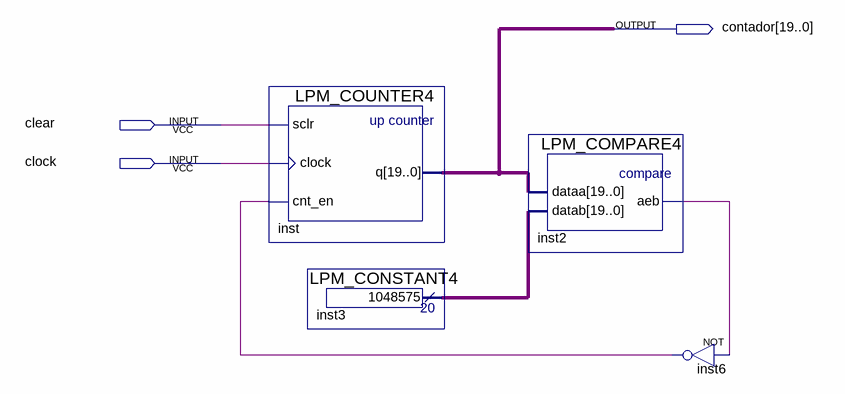
[diagram p0: schematic sheet]
// Quartus schematic Counter.bdf as structural Verilog: 4 symbols, 3 pins
module Counter (
  input  clear,
  input  clock,
  output [19:0] contador
);

  wire inst2_aeb, inst6_out;
  wire [19:0] inst3_result;

  LPM_COUNTER4 inst (.sclr(clear), .clock(clock), .cnt_en(inst6_out), .q(contador));
  LPM_CONSTANT4 inst3 (.result(inst3_result));
  LPM_COMPARE4 inst2 (.dataa(contador), .datab(inst3_result), .aeb(inst2_aeb));
  not inst6 (inst6_out, inst2_aeb);
endmodule
